# Altium schematic sheet Radios_Comunitarias.SchDoc
size A4
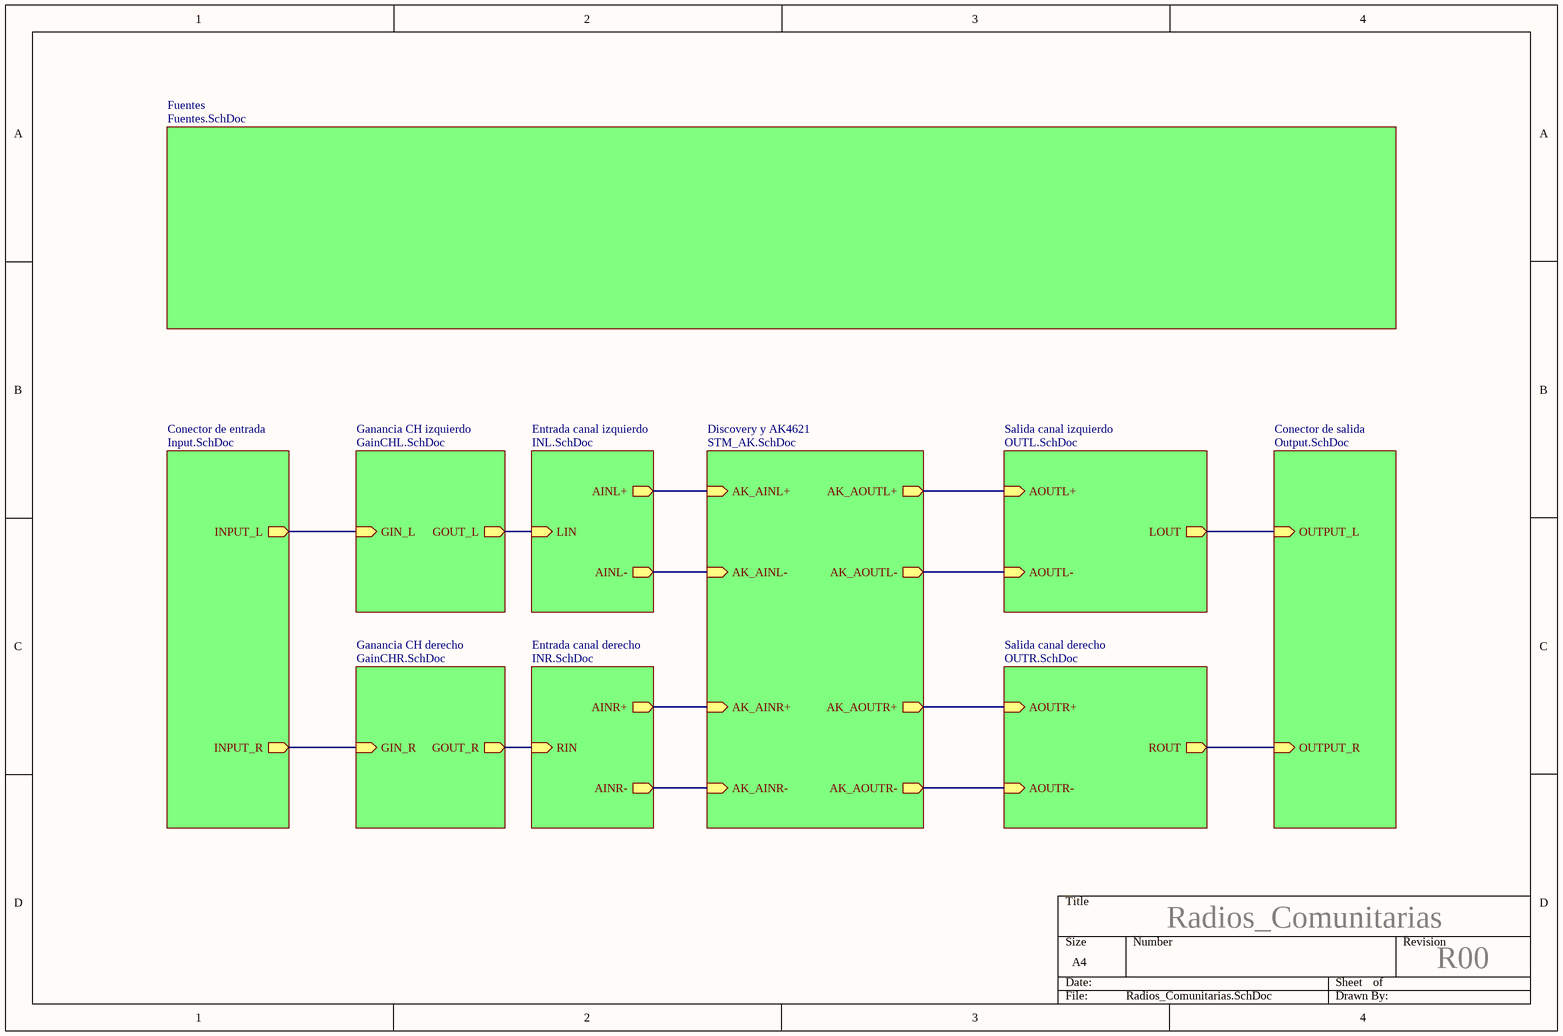
[diagram p0: Radios_Comunitarias.SchDoc]

## Sub-sheets
Conector de entrada = Input.SchDoc: INPUT_L (out), INPUT_R (out)
Conector de salida = Output.SchDoc: OUTPUT_R (in), OUTPUT_L (in)
Discovery y AK4621 = STM_AK.SchDoc: AK_AINL+ (in), AK_AINL- (in), AK_AINR- (in), AK_AINR+ (in), AK_AOUTL+ (out), AK_AOUTL- (out), AK_AOUTR+ (out), AK_AOUTR- (out)
Entrada canal derecho = INR.SchDoc: RIN (in), AINR+ (out), AINR- (out)
Entrada canal izquierdo = INL.SchDoc: LIN (in), AINL+ (out), AINL- (out)
Fuentes = Fuentes.SchDoc: no entries
Ganancia CH derecho = GainCHR.SchDoc: GOUT_R (out), GIN_R (in)
Ganancia CH izquierdo = GainCHL.SchDoc: GIN_L (in), GOUT_L (out)
Salida canal derecho = OUTR.SchDoc: AOUTR- (in), AOUTR+ (in), ROUT (out)
Salida canal izquierdo = OUTL.SchDoc: AOUTL+ (in), AOUTL- (in), LOUT (out)

## Nets
(unnamed): sheet Entrada canal izquierdo/LIN, sheet Ganancia CH izquierdo/GOUT_L
(unnamed): sheet Entrada canal izquierdo/AINL+, sheet Discovery y AK4621/AK_AINL+
(unnamed): sheet Entrada canal izquierdo/AINL-, sheet Discovery y AK4621/AK_AINL-
(unnamed): sheet Entrada canal derecho/RIN, sheet Ganancia CH derecho/GOUT_R
(unnamed): sheet Entrada canal derecho/AINR+, sheet Discovery y AK4621/AK_AINR+
(unnamed): sheet Entrada canal derecho/AINR-, sheet Discovery y AK4621/AK_AINR-
(unnamed): sheet Discovery y AK4621/AK_AOUTL+, sheet Salida canal izquierdo/AOUTL+
(unnamed): sheet Discovery y AK4621/AK_AOUTL-, sheet Salida canal izquierdo/AOUTL-
(unnamed): sheet Discovery y AK4621/AK_AOUTR+, sheet Salida canal derecho/AOUTR+
(unnamed): sheet Discovery y AK4621/AK_AOUTR-, sheet Salida canal derecho/AOUTR-
(unnamed): sheet Salida canal izquierdo/LOUT, sheet Conector de salida/OUTPUT_L
(unnamed): sheet Salida canal derecho/ROUT, sheet Conector de salida/OUTPUT_R
(unnamed): sheet Conector de entrada/INPUT_L, sheet Ganancia CH izquierdo/GIN_L
(unnamed): sheet Conector de entrada/INPUT_R, sheet Ganancia CH derecho/GIN_R

## Notes on the sheet
- Radios_Comunitarias
- R00